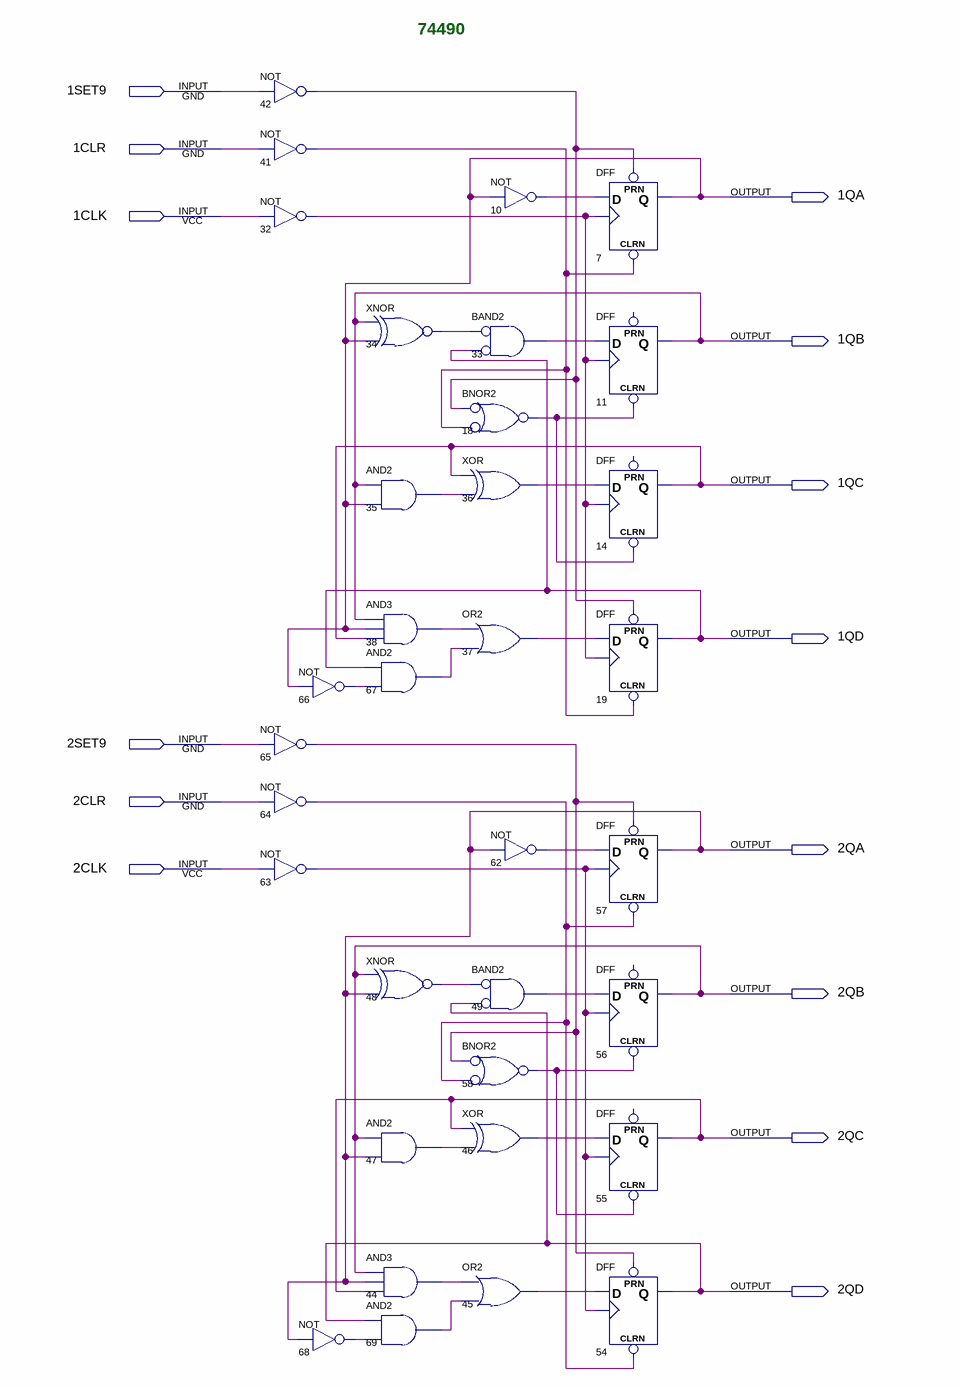
[diagram p0: schematic sheet]
// Quartus schematic 74490.bdf as structural Verilog: 34 symbols, 14 pins
module \74490  (
  input  \1SET9 ,
  input  \1CLR ,
  input  \1CLK ,
  input  \2SET9 ,
  input  \2CLR ,
  input  \2CLK ,
  output \1QA ,
  output \1QB ,
  output \1QC ,
  output \1QD ,
  output \2QA ,
  output \2QB ,
  output \2QC ,
  output \2QD 
);

  wire n10_out, n18_out, n32_out, n33_out, n34_out, n35_out, n36_out, n37_out, n38_out, n41_out, n42_out,
       n44_out, n45_out, n46_out, n47_out, n48_out, n49_out, n58_out, n62_out, n63_out, n64_out, n65_out,
       n66_out, n67_out, n68_out, n69_out;

  not u_42 (n42_out, \1SET9 );
  not u_41 (n41_out, \1CLR );
  not u_32 (n32_out, \1CLK );
  not u_66 (n66_out, \1QA );
  not u_65 (n65_out, \2SET9 );
  not u_64 (n64_out, \2CLR );
  not u_63 (n63_out, \2CLK );
  not u_68 (n68_out, \2QA );
  xnor u_34 (n34_out, \1QB , \1QA );
  and u_35 (n35_out, \1QB , \1QA );
  and u_38 (n38_out, \1QB , \1QA , \1QC );
  and u_67 (n67_out, \1QD , n66_out);
  xnor u_48 (n48_out, \2QB , \2QA );
  and u_47 (n47_out, \2QB , \2QA );
  and u_44 (n44_out, \2QB , \2QA , \2QC );
  and u_69 (n69_out, \2QD , n68_out);
  not u_10 (n10_out, \1QA );
  and u_33 (n33_out, ~n34_out, ~\1QD );  // BAND2
  nor u_18 (n18_out, ~n42_out, ~n41_out);  // BNOR2
  xor u_36 (n36_out, \1QC , n35_out);
  or u_37 (n37_out, n38_out, n67_out);
  not u_62 (n62_out, \2QA );
  and u_49 (n49_out, ~n48_out, ~\2QD );  // BAND2
  nor u_58 (n58_out, ~n65_out, ~n64_out);  // BNOR2
  xor u_46 (n46_out, \2QC , n47_out);
  or u_45 (n45_out, n44_out, n69_out);
  DFF u_7 (.CLRN(n41_out), .CLK(n32_out), .D(n10_out), .PRN(n42_out), .Q(\1QA ));
  DFF u_11 (.CLRN(n18_out), .CLK(n32_out), .D(n33_out), .Q(\1QB ));  // open: PRN
  DFF u_14 (.CLRN(n18_out), .CLK(n32_out), .D(n36_out), .Q(\1QC ));  // open: PRN
  DFF u_19 (.CLRN(n41_out), .CLK(n32_out), .D(n37_out), .PRN(n42_out), .Q(\1QD ));
  DFF u_57 (.CLRN(n64_out), .CLK(n63_out), .D(n62_out), .PRN(n65_out), .Q(\2QA ));
  DFF u_56 (.CLRN(n58_out), .CLK(n63_out), .D(n49_out), .Q(\2QB ));  // open: PRN
  DFF u_55 (.CLRN(n58_out), .CLK(n63_out), .D(n46_out), .Q(\2QC ));  // open: PRN
  DFF u_54 (.CLRN(n64_out), .CLK(n63_out), .D(n45_out), .PRN(n65_out), .Q(\2QD ));

  // Notes on the sheet:
  //   74490
endmodule
